# EAGLE design leadtech-arduino-CSPG_concept (EAGLE 9.1.3)
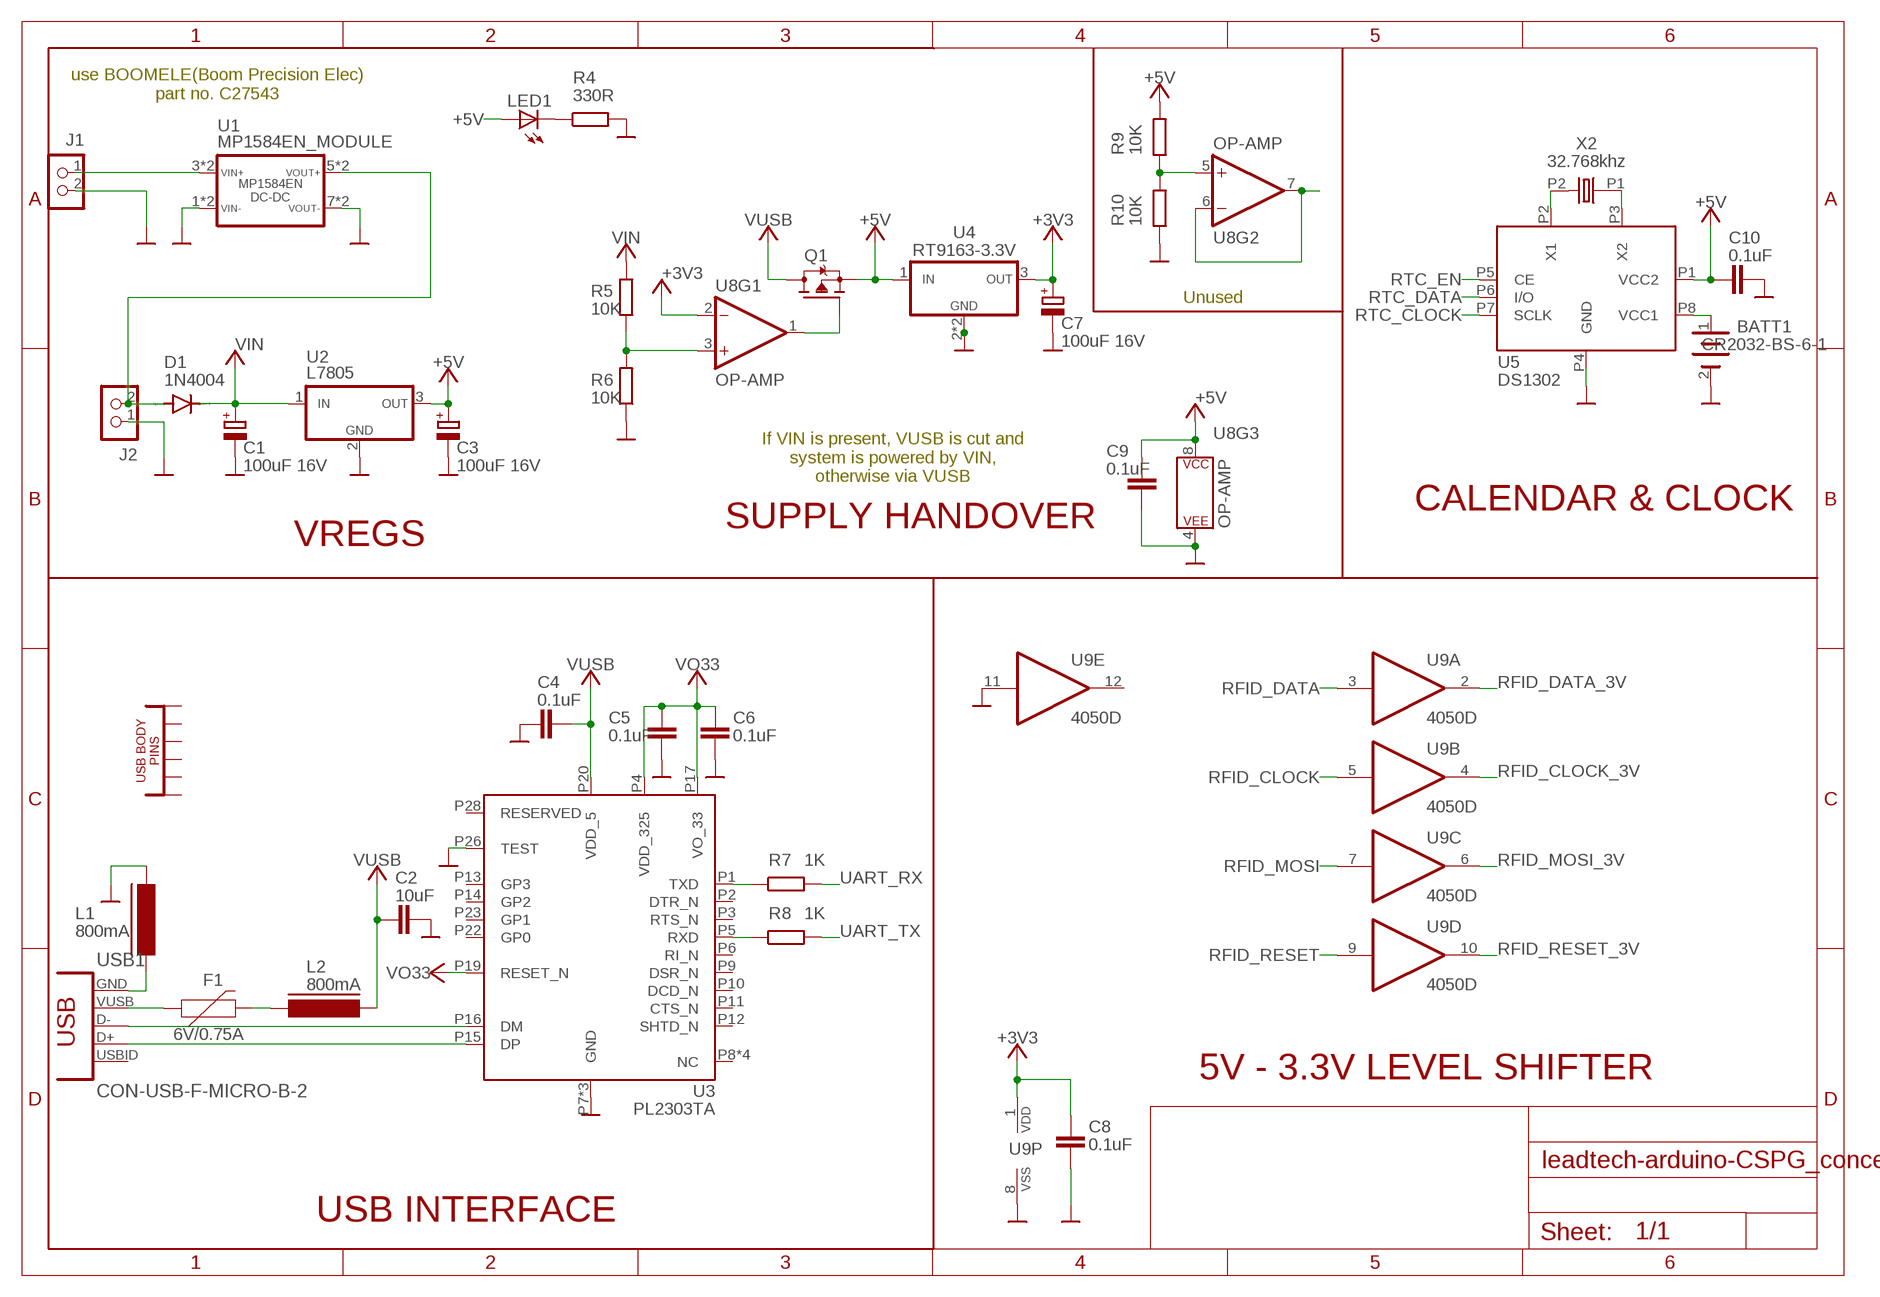
[diagram p0: schematic, sheet 1, part 1 of 2]
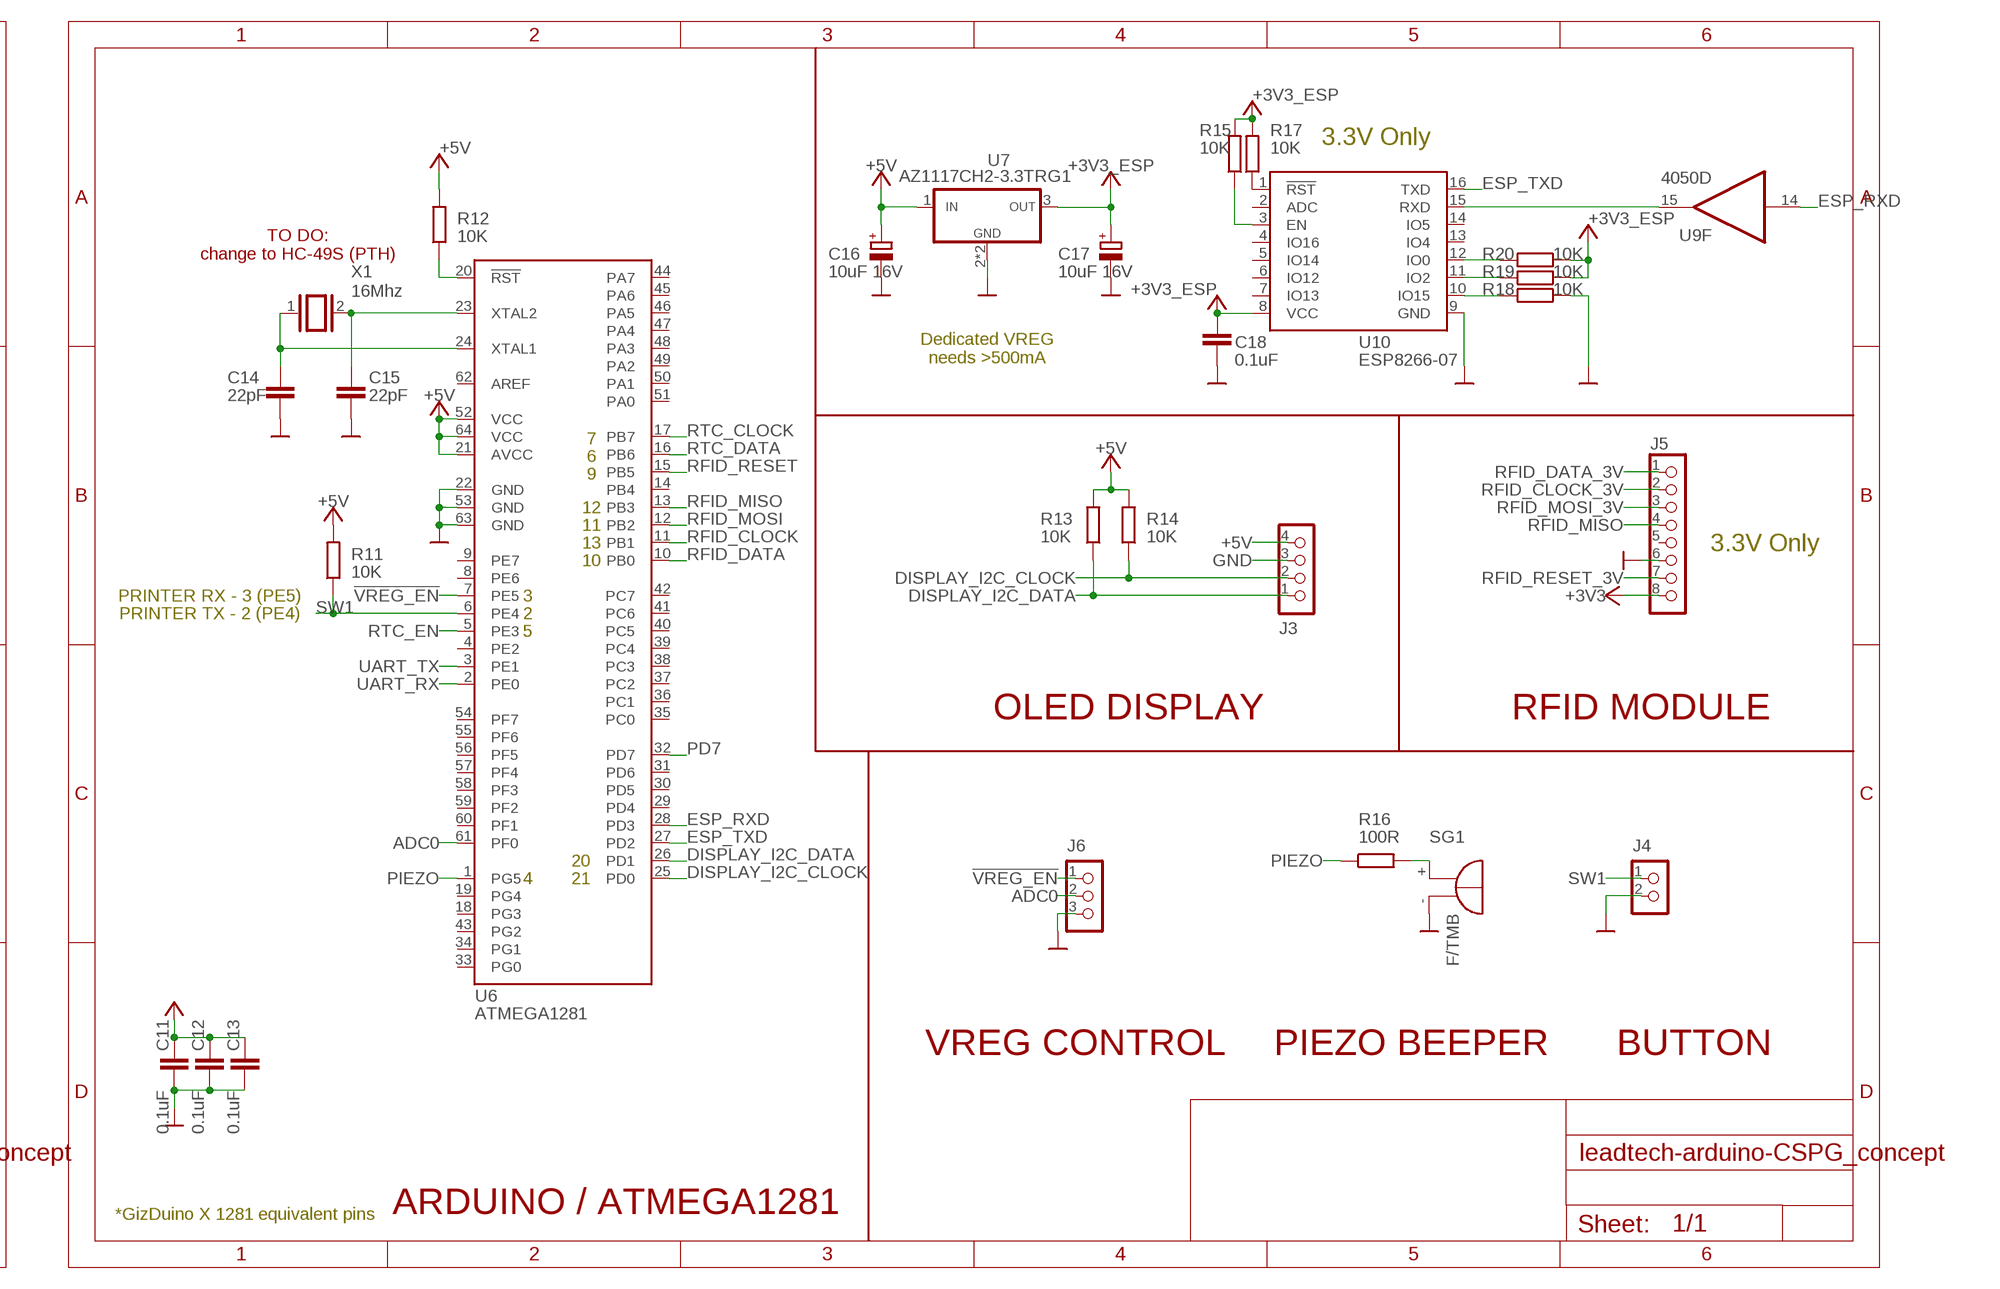
[diagram p1: schematic, sheet 1, part 2 of 2]

## Parts
BATT1  CR2032-BS-6-1  CR2032  [CR2032-BS-6]
C1  100uF 16V  CAPACITOR-POLCASE_C  [CASE_C]
C2  10uF  C-EUC0603  [C0603]
C3  100uF 16V  CAPACITOR-POLCASE_C  [CASE_C]
C4  0.1uF  C-EUC0603  [C0603]
C5  0.1uF  C-EUC0603  [C0603]
C6  0.1uF  C-EUC0603  [C0603]
C7  100uF 16V  CAPACITOR-POLCASE_C  [CASE_C]
C8  0.1uF  C-EUC0603  [C0603]
C9  0.1uF  C-EUC0603  [C0603]
C10  0.1uF  C-EUC0603  [C0603]
C11  0.1uF  C-EUC0603  [C0603]
C12  0.1uF  C-EUC0603  [C0603]
C13  0.1uF  C-EUC0603  [C0603]
C14  22pF  C-EUC0603  [C0603]
C15  22pF  C-EUC0603  [C0603]
C16  10uF 16V  CAPACITOR_POL-CASE_B  [CASE_B]
C17  10uF 16V  CAPACITOR_POL-CASE_B  [CASE_B]
C18  0.1uF  C-EUC0603  [C0603]
D1  1N4004  [DO41-10]
F1  6V/0.75A  PPTC_0.75A  [1206]
J1  CON_HX42003_2  [HX42003-2WAF]
J2  CON_HEADER_1X02-PTH  [M1X2]
J3  2510-4AGW  CON_KF2510-4AGW-2  [KF2510-4AGW-2]
J4  CON_KF2510-2AGW  [KF2510-2AGW]
J5  CON_HEADER_1X08-PTH  [M1X8]
J6  CON_KF2510-3A  [KF2510-3A]
L1  800mA  FERRITE-0805  [FB805]
L2  800mA  FERRITE-0805  [FB805]
LED1  LED-0805  [LED-805]
Q1  TRANSISTOR_FET_TSM2301CX  [SOT-23]
R4  330R  RESISTOR-0603  [R603]
R5  10K  RESISTOR-0603  [R603]
R6  10K  RESISTOR-0603  [R603]
R7  1K  RESISTOR-0603  [R603]
R8  1K  RESISTOR-0603  [R603]
R9  10K  RESISTOR-0603  [R603]
R10  10K  RESISTOR-0603  [R603]
R11  10K  R-EU_R0603  [R0603]
R12  10K  R-EU_R0603  [R0603]
R13  10K  R-EU_R0603  [R0603]
R14  10K  R-EU_R0603  [R0603]
R15  10K  RESISTOR-0603  [R603]
R16  100R  R-EU_R0603  [R0603]
R17  10K  RESISTOR-0603  [R603]
R18  10K  RESISTOR-0603  [R603]
R19  10K  RESISTOR-0603  [R603]
R20  10K  RESISTOR-0603  [R603]
SG1  F/TMB  [F/TMB]
U1  MP1584EN_MODULE  [MP1584EN_DCDC_MODULE]
U2  L7805  VREG-7805  [DPAK]
U3  PL2303TA  PL2303HX  [SSOP-28]
U4  RT9163-3.3V  VREG-RT9163  [SOT-223]
U5  DS1302  [SOIC-8]
U6  ATMEGA1281  [TQFP-64]
U7  AZ1117CH2-3.3TRG1  VREG-RT9163  [SOT-223]
U8  OP-AMP  OPAMP-DUALU  [SO08]
U9  4050D  [SO16]
U10  ESP8266-07  [ESP8266-07]
USB1  CON-USB-F-MICRO-B-2  [CON_USB_MICRO-B-2-SD-47589-001]
X1  16Mhz  XTAL/S  [QS]
X2  32.768khz  OSC-XTALTC-26  [TC-26]

## Nets
!VREG_EN: J6.1 U6.7(PE5)
+3V3: C7.+ C8.2 J5.8 U4.3(VOUT) U8.2(-IN) U9.1(P:VDD) ; supply symbol labelled SUPPLY_+5V
+3V3_ESP: C17.+ C18.2 R15.2 R17.2 R18.1 R19.1 U7.3(VOUT) U10.8(VCC) ; supply symbol labelled SUPPLY_+5V
+5V: C3.+ C9.2 C10.1 C11.1 C12.1 C13.1 C16.+ J3.4 LED1.A Q1.2(S) R9.2 R11.2 R12.2 R13.2 R14.2 U2.3(VOUT) U4.1(VIN) U5.P1(VCC2) U6.21(AVCC) U6.52(VCC) U6.64(VCC) U7.1(VIN) U8.8(P$V+) ; supply symbol labelled SUPPLY_+5V
ADC0: J6.2 U6.61(PF0)
DISPLAY_I2C_CLOCK: J3.2 R14.1 U6.25(PD0)
DISPLAY_I2C_DATA: J3.1 R13.1 U6.26(PD1)
ESP_RXD: U6.28(PD3) U9.14(F:I)
ESP_TXD: U6.27(PD2) U10.16(TXD)
GND: BATT1.2(B-) C1.- C2.1 C3.- C4.1 C5.2 C6.2 C7.- C8.1 C9.1 C10.2 C11.2 C12.2 C13.2 C14.1 C15.1 C16.- C17.- C18.1 J1.2 J2.1 J3.3 J4.2 J5.6 J6.3 L1.1 R4.2 R6.1 R10.1 R20.1 SG1.- U1.1(VIN-) U1.2(VIN-) U1.7(VOUT-) U1.8(VOUT-) U2.2(GND) U3.P7(GND) U3.P18(GND) U3.P25(GND) U3.P26(TEST) U4.2(GND) U4.4(GND) U5.P4(GND) U6.22(GND) U6.53(GND) U6.63(GND) U7.2(GND) U7.4(GND) U8.4(P$V-) U9.8(P:VSS) U9.11(E:I) U10.9(GND) ; supply symbol labelled SUPPLY_GND
N$1: R17.1 U10.1(!RST)
N$2: R15.1 U10.3(EN)
N$3: R12.1 U6.20(!RST)
N$4: Q1.1(G) U8.1(OUT)
N$5: R5.1 R6.2 U8.3(+IN)
N$6: U8.6(-IN) U8.7(OUT)
N$7: J1.1 U1.3(VIN+) U1.4(VIN+)
N$8: C15.2 U6.23(XTAL2) X1.2
N$9: R9.1 R10.2 U8.5(+IN)
N$10: C14.2 U6.24(XTAL1) X1.1
N$11: U3.P16(DM) USB1.P2(D-)
N$12: U3.P15(DP) USB1.P3(D+)
N$13: F1.1 USB1.P1(VUSB)
N$14: F1.2 L2.2
N$16: L1.2 USB1.P5(GND)
N$17: R7.1 U3.P1(TXD)
N$18: R8.1 U3.P5(RXD)
N$19: D1.A J2.2 U1.5(VOUT+) U1.6(VOUT+)
N$20: R16.2 SG1.+
N$21: LED1.C R4.1
N$22: U5.P3(X2) X2.P1
N$23: U5.P2(X1) X2.P2
N$24: BATT1.1(B+) U5.P8(VCC1)
N$25: R20.2 U10.10(IO15)
N$26: R19.2 U10.11(IO2)
N$27: R18.2 U10.12(IO0)
N$28: U9.15(F:O) U10.15(RXD)
PD7: U6.32(PD7)
PIEZO: R16.1 U6.1(PG5)
RFID_CLOCK: U6.11(PB1) U9.5(B:I)
RFID_CLOCK_3V: J5.2 U9.4(B:O)
RFID_DATA: U6.10(PB0) U9.3(A:I)
RFID_DATA_3V: J5.1 U9.2(A:O)
RFID_MISO: J5.4 U6.13(PB3)
RFID_MOSI: U6.12(PB2) U9.7(C:I)
RFID_MOSI_3V: J5.3 U9.6(C:O)
RFID_RESET: U6.15(PB5) U9.9(D:I)
RFID_RESET_3V: J5.7 U9.10(D:O)
RTC_CLOCK: U5.P7(SCLK) U6.17(PB7)
RTC_DATA: U5.P6(I/O) U6.16(PB6)
RTC_EN: U5.P5(CE) U6.5(PE3)
SW1: J4.1 R11.1 U6.6(PE4)
UART_RX: R7.2 U6.2(PE0)
UART_TX: R8.2 U6.3(PE1)
VIN: C1.+ D1.C R5.2 U2.1(VIN) ; supply symbol labelled SUPPLY_+5V
VO33: C5.1 C6.1 U3.P4(VDD_325) U3.P17(VO_33) U3.P19(RESET_N) ; supply symbol labelled SUPPLY_+5V
VUSB: C2.2 C4.2 L2.1 Q1.3(D) U3.P20(VDD_5) ; supply symbol labelled SUPPLY_+5V
Unconnected: J5.5 U3.P2(DTR_N) U3.P3(RTS_N) U3.P6(RI_N) U3.P8(NC) U3.P9(DSR_N) U3.P10(DCD_N) U3.P11(CTS_N) U3.P12(SHTD_N) U3.P13(GP3) U3.P14(GP2) U3.P21(NC) U3.P22(GP0) U3.P23(GP1) U3.P24(NC) U3.P27(NC) U3.P28(RESERVED) U6.4(PE2) U6.8(PE6) U6.9(PE7) U6.14(PB4) U6.18(PG3) U6.19(PG4) U6.29(PD4) U6.30(PD5) U6.31(PD6) U6.33(PG0) U6.34(PG1) U6.35(PC0) U6.36(PC1) U6.37(PC2) U6.38(PC3) U6.39(PC4) U6.40(PC5) U6.41(PC6) U6.42(PC7) U6.43(PG2) U6.44(PA7) U6.45(PA6) U6.46(PA5) U6.47(PA4) U6.48(PA3) U6.49(PA2) U6.50(PA1) U6.51(PA0) U6.54(PF7) U6.55(PF6) U6.56(PF5) U6.57(PF4) U6.58(PF3) U6.59(PF2) U6.60(PF1) U6.62(AREF) U9.12(E:O) U10.2(ADC) U10.4(IO16) U10.5(IO14) U10.6(IO12) U10.7(IO13) U10.13(IO4) U10.14(IO5) USB1.BODY@1 USB1.BODY@2 USB1.BODY@3 USB1.BODY@4 USB1.BODY@5 USB1.BODY@6 USB1.BODY@7 USB1.BODY@8 USB1.BODY@9 USB1.BODY@10 USB1.P4(USBID)

## Notes on the sheet
- use BOOMELE(Boom Precision Elec)
  part no. C27543
- 3.3V Only
- TO DO:
  change to HC-49S (PTH)
- Unused
- Dedicated VREG
  needs >500mA
- 7
- If VIN is present, VUSB is cut and
  system is powered by VIN,
  otherwise via VUSB
- 6
- 9
- CALENDAR & CLOCK | 12
- SUPPLY HANDOVER | 11
- VREGS | 13 | 3.3V Only
- 10
- PRINTER RX - 3 (PE5) | 3
- PRINTER TX - 2 (PE4) | 2
- 5
- OLED DISPLAY | RFID MODULE
- 20
- 4 | 21
- VREG CONTROL | PIEZO BEEPER | BUTTON
- 5V - 3.3V LEVEL SHIFTER
- USB INTERFACE | *GizDuino X 1281 equivalent pins | ARDUINO / ATMEGA1281

## Library data of the parts
BATT1 = trosh_devices.eagle.v9:CR2032
C1 C3 C7 = trosh_devices.eagle.v9:CAPACITOR-POL
C2 C4-C6 C8-C15 C18 = rcl:C-EU: CAPACITOR, European symbol; SPICEPREFIX: C
C16 C17 = dp_devices.v6:CAPACITOR_POL: Polarized capacitor in various packages
D1 = diode:1N4004: DIODE general purpose rectifier, 1 A
F1 = SparkFun-Fuses:PPTC: Resettable Fuse PPTC Resettable Fuse. Really a sort of resistor with a polymeric positive temperature coefficient whose resistance increases dramatically with an increase in temperature. When heated by the power passing through the resistance rises causing the current to be limited, protecting the circuit. This is achieved by the transition of the polymer from a crystalline to an amorphous state where the conductive carbon separates breaking the conductive pathways found in the cool crystalline structure. When a PPTC cools back down it resumes conducting letting the circuit turn back on. SparkFun Products: SparkFun RedBoard - Programmed with Arduino <https://www.sparkfun.com/products/12757> Pro Micro - 5V/16MHz <https://www.sparkfun.com/products/12640> Arduino Pro 328 - 5V/16MHz <https://www.sparkfun.com/products/10915> MP3 Trigger <https://www.sparkfun.com/products/13720>; PROD_ID: RES-11150
J1 = trosh_devices.eagle.v9:CON_HX42003_2: Similar 5569 series
J2 = dp_devices.v6:CON_HEADER_1X02
J3 = trosh_devices.eagle.v9:CON_KF2510-4AGW-2
J4 = trosh_devices.eagle.v9:CON_KF2510-2AGW: KF2510 alike part no: C30436
J5 = dp_devices.v6:CON_HEADER_1X08
J6 = trosh_devices.eagle.v9:CON_KF2510-3A
L1 L2 = dp_devices.v6:FERRITE: Ferrite bead in various packages
LED1 = dp_devices.v6:LED: Light Emitting Diode
Q1 = dp_devices.v6:TRANSISTOR_FET_TSM2301CX: 20V P-Channel Enhancement Mode MOSFET
R4-R10 R15 R17-R20 = dp_devices.v6:RESISTOR
R11-R14 R16 = rcl:R-EU_: RESISTOR, European symbol; SPICEPREFIX: R
SG1 = buzzer:F/TMB: BUZZER Source: Buerklin; OC_FARNELL: unknown; OC_NEWARK: unknown
U1 = trosh_devices.eagle.v9:MP1584EN_MODULE
U2 = trosh_devices.eagle.v9:VREG-7805: 1.5A Positive voltage regulator
U3 = trosh_devices.eagle.v9:PL2303HX: USB to serial bridge controller
U4 U7 = trosh_devices.eagle.v9:VREG-RT9163: 500mA Low Dropout Positive Voltage Regulator
U5 = trosh_devices.eagle.v9:DS1302: Trickle-charge timekeeping chip
U6 = trosh_devices.eagle.v9:ATMEGA1281
U8 = SparkFun-IC-Amplifiers:OPAMP-DUAL: Generic op-amp footprint This component is for the standard 358 pinning of a dual op-amp From the LM358 datasheet: Pin 1: Output A Pin 2: Inverting Input A Pin 3: Non-Inverting Input A Pin 4: Gnd Pin 5: Non-Inverting Input B Pin 6: Inverting Input B Pin 7: Output B Pin 8: V+; PROD_ID: NA-XXXXX
U9 = 40xx:4050: Hex non-inverting BUFFER
U10 = trosh_devices.eagle.v9:ESP8266-07: ESP-07 802.11 b/g/n Wi-Fi Module
USB1 = dp_devices.v6:CON-USB-F-MICRO-B-2: Micro USB based on molex SD-47589-001
X1 = special:XTAL/S: CRYSTAL
X2 = dp_devices.v6:OSC-XTAL

## Board
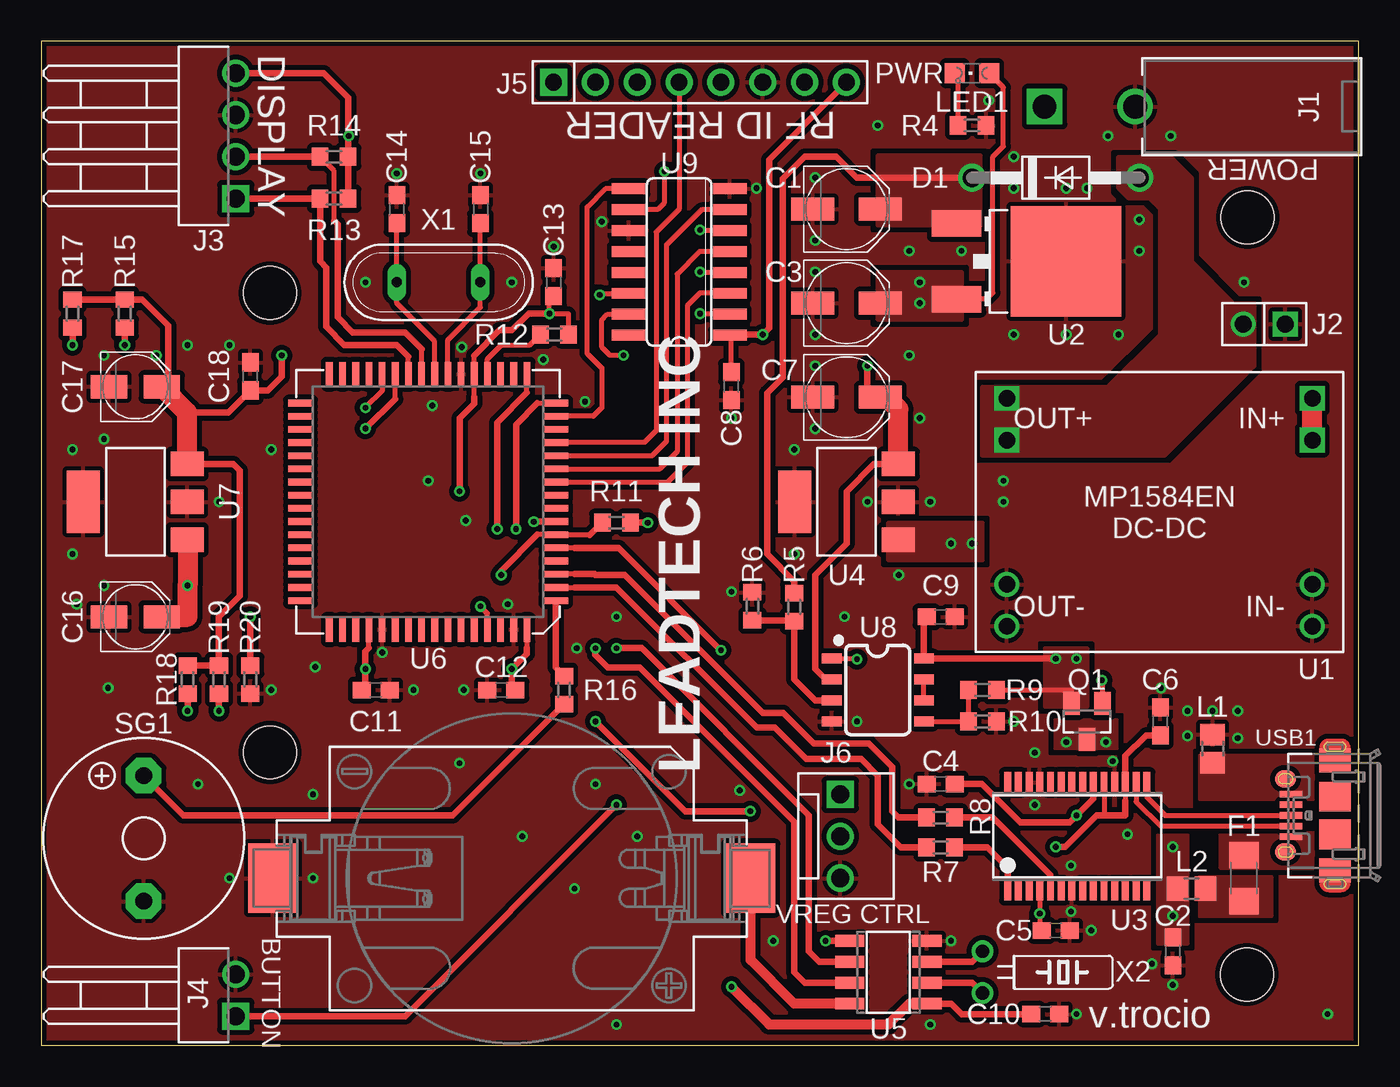
[diagram p2: board, top side]
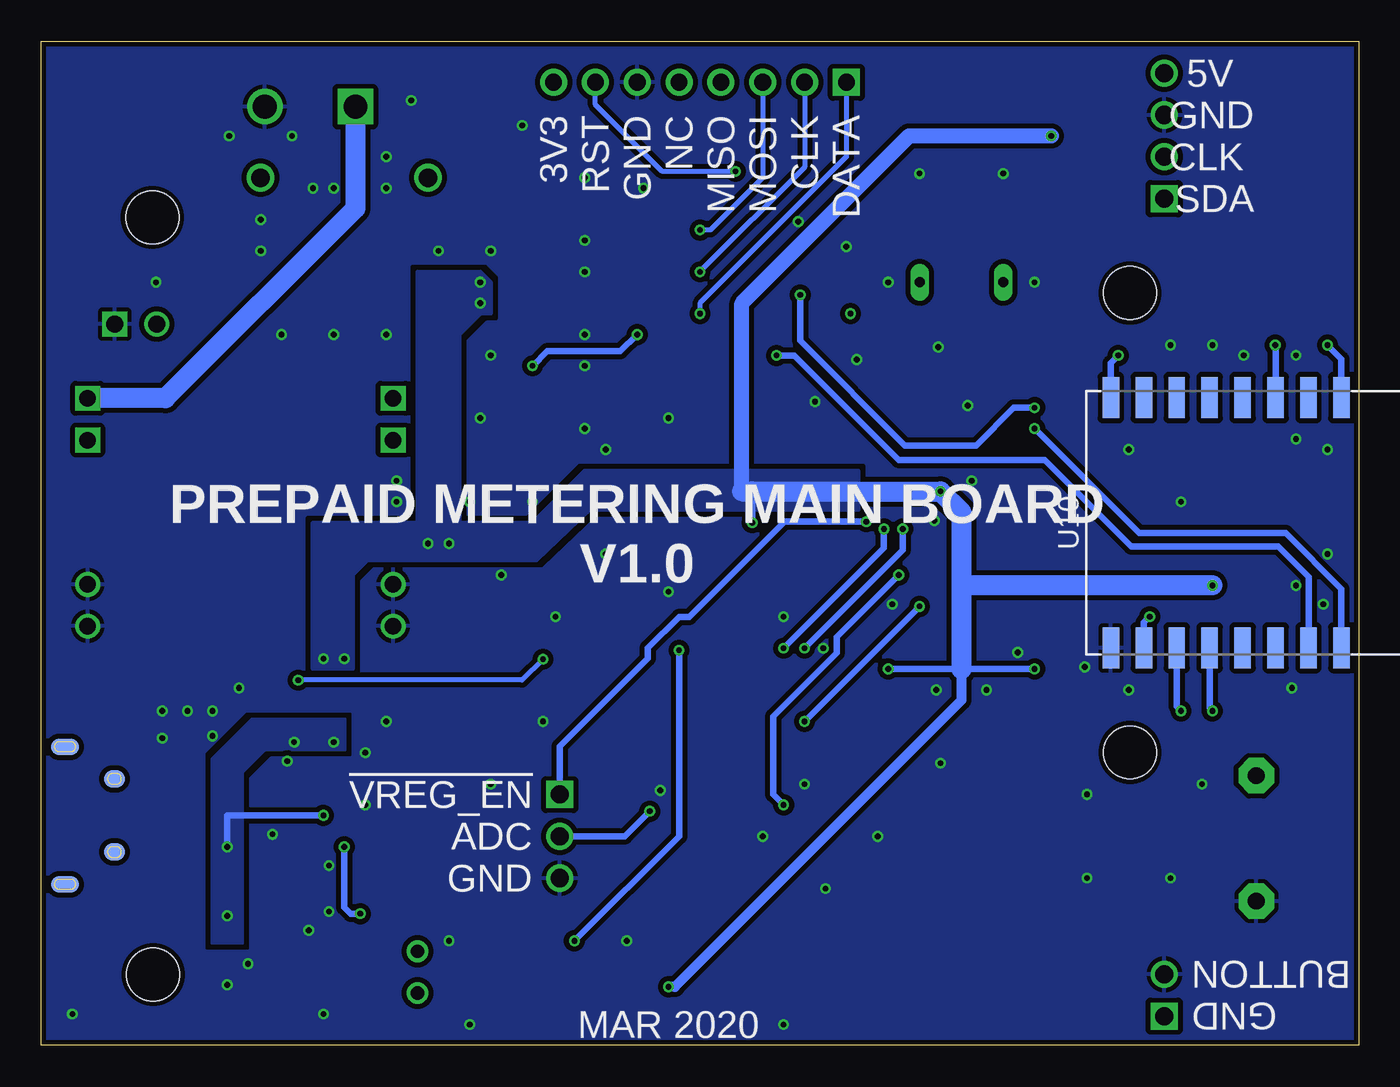
[diagram p3: board, bottom side, seen from below]

Size 80 x 61 mm. Coordinates in mm from the lower left corner, seen from the top.
Outline: 0,61 0,0 80,0 80,61 0,61
Copper layers (1*16): Top 0.035mm / dielectric 1.5mm / Bottom 0.035mm
Design rules "dirt_cheap_dirty_boards.v1.1": minimum track width 6mil, minimum drill 12mil, track to track 6mil, track to pad 6mil, pad to pad 6mil, via to via 6mil, smd to smd 0mil, copper to edge 10mil, drill to drill 10mil, minimum pad ring 10mil, minimum via ring 6mil, stop-mask expansion 2mil, vias tented up to drill 25mil, thermal gap 10mil
Holes 3.2 mm at 13.9,45.7 73.25,50.3 73.2,4.3 13.9,17.8
tKeepout: area 70.2,1.3 to 76.2,7.3; area 70.2,47.3 to 76.2,53.3; area 10.9,42.7 to 16.9,48.7; area 10.9,14.8 to 16.9,20.8

### Footprints (pad centres in the part's own frame; a part is rotated, then mirrored left to right if it is on the bottom)
CR2032-BS-6 = smd 3 x 4.2: 1 14.5,0; 2 -14.5,0
CASE_C = smd 2.6 x 1.4: + 2.05,0; - -2.05,0
C0603 = smd 1.1 x 1: 1 -0.85,0; 2 0.85,0
CASE_B = smd 2.2 x 1.4: + 1.6,0; - -1.6,0
DO41-10 = drill 1.118: A 5.08,0; C -5.08,0
1206 = smd 1.6 x 1.8: 1 -1.4,0; 2 1.4,0
HX42003-2WAF = drill 1.44 square: 1 0,5.5 | drill 1.44: 2 0,0
M1X2 = drill 1.02 square: 1 -1.27,0 | drill 1.02: 2 1.27,0
KF2510-4AGW-2 = drill 1.1 square: 1 0,0 | drill 1.1: 2 2.54,0; 3 5.08,0; 4 7.62,0
KF2510-2AGW = drill 1.1 square: 1 0,0 | drill 1.1: 2 2.54,0
M1X8 = drill 1.02 pad 1.632 square: 1 -8.89,0 | drill 1.02 pad 1.632: 2 -6.35,0; 3 -3.81,0; 4 -1.27,0; 5 1.27,0; 6 3.81,0; 7 6.35,0; 8 8.89,0
KF2510-3A = drill 1.1 square: 1 0,0 | drill 1.1: 2 -2.54,0; 3 -5.08,0
FB805 = smd 1.3 x 1.5: 1 -0.85,0; 2 0.85,0
LED-805 = smd 1.2 x 1.2: A 0,-1.05; C 0,1.05
SOT-23 = smd 1 x 1.4: 1 -0.95,-1.1; 2 0.95,-1.1; 3 0,1.1
R603 = smd 1 x 1.1: 1 -0.85,0; 2 0.85,0
R0603 = smd 1 x 1.1: 1 -0.85,0; 2 0.85,0
F/TMB = drill 1.016 pad 2.159 octagon: + 3.81,0; - -3.81,0
MP1584EN_DCDC_MODULE = drill 1: 1 -9.271,6.922; 2 -9.271,4.382; 7 9.271,4.382; 8 9.271,6.922 | drill 1 square: 3 -9.271,-4.382; 4 -9.271,-6.922; 5 9.271,-6.922; 6 9.271,-4.382
DPAK = smd 1.6 x 3: 1 -2.3,-6.65; 3 2.3,-6.65 | smd 6.7 x 6.7: 2 0,0
SSOP-28 = smd 0.42 x 1.25: P1 -4.225,-3.275; P2 -3.575,-3.275; P3 -2.925,-3.275; P4 -2.275,-3.275; P5 -1.625,-3.275; P6 -0.975,-3.275; P7 -0.325,-3.275; P8 0.325,-3.275; P9 0.975,-3.275; P10 1.625,-3.275; P11 2.275,-3.275; P12 2.925,-3.275; P13 3.575,-3.275; P14 4.225,-3.275; P15 4.225,3.275; P16 3.575,3.275; P17 2.925,3.275; P18 2.275,3.275; P19 1.625,3.275; P20 0.975,3.275; P21 0.325,3.275; P22 -0.325,3.275; P23 -0.975,3.275; P24 -1.625,3.275; P25 -2.275,3.275; P26 -2.925,3.275; P27 -3.575,3.275; P28 -4.225,3.275
SOT-223 = smd 1.5 x 2: 1 -2.3,-3.15; 2 0,-3.15; 3 2.3,-3.15 | smd 3.8 x 2: 4 0,3.15
SOIC-8 = smd 0.72 x 1.78: P1 -1.905,-2.34; P2 -0.635,-2.34; P3 0.635,-2.34; P4 1.905,-2.34; P5 1.905,2.34; P6 0.635,2.34; P7 -0.635,2.34; P8 -1.905,2.34
TQFP-64 = smd 1.5 x 0.406: 1 -7.75,6; 2 -7.75,5.2; 3 -7.75,4.4; 4 -7.75,3.6; 5 -7.75,2.8; 6 -7.75,2; 7 -7.75,1.2; 8 -7.75,0.4; 9 -7.75,-0.4; 10 -7.75,-1.2; 11 -7.75,-2; 12 -7.75,-2.8; 13 -7.75,-3.6; 14 -7.75,-4.4; 15 -7.75,-5.2; 16 -7.75,-6; 33 7.75,-6; 34 7.75,-5.2; 35 7.75,-4.4; 36 7.75,-3.6; 37 7.75,-2.8; 38 7.75,-2; 39 7.75,-1.2; 40 7.75,-0.4; 41 7.75,0.4; 42 7.75,1.2; 43 7.75,2; 44 7.75,2.8; 45 7.75,3.6; 46 7.75,4.4; 47 7.75,5.2; 48 7.75,6 | smd 0.406 x 1.5: 17 -6,-7.75; 18 -5.2,-7.75; 19 -4.4,-7.75; 20 -3.6,-7.75; 21 -2.8,-7.75; 22 -2,-7.75; 23 -1.2,-7.75; 24 -0.4,-7.75; 25 0.4,-7.75; 26 1.2,-7.75; 27 2,-7.75; 28 2.8,-7.75; 29 3.6,-7.75; 30 4.4,-7.75; 31 5.2,-7.75; 32 6,-7.75; 49 6,7.75; 50 5.2,7.75; 51 4.4,7.75; 52 3.6,7.75; 53 2.8,7.75; 54 2,7.75; 55 1.2,7.75; 56 0.4,7.75; 57 -0.4,7.75; 58 -1.2,7.75; 59 -2,7.75; 60 -2.8,7.75; 61 -3.6,7.75; 62 -4.4,7.75; 63 -5.2,7.75; 64 -6,7.75
SO08 = smd 0.6 x 1.2: 1 -1.905,-2.8; 2 -0.635,-2.8; 3 0.635,-2.8; 4 1.905,-2.8; 5 1.905,2.8; 6 0.635,2.8; 7 -0.635,2.8; 8 -1.905,2.8
SO16 = smd 0.66 x 2.032: 1 -4.445,-3.073; 2 -3.175,-3.073; 3 -1.905,-3.073; 4 -0.635,-3.073; 5 0.635,-3.073; 6 1.905,-3.073; 7 3.175,-3.073; 8 4.445,-3.073; 9 4.445,3.073; 10 3.175,3.073; 11 1.905,3.073; 12 0.635,3.073; 13 -0.635,3.073; 14 -1.905,3.073; 15 -3.175,3.073; 16 -4.445,3.073
ESP8266-07 = smd 2.5 x 1: 1 -7.6,7.2; 2 -7.6,5.2; 3 -7.6,3.2; 4 -7.6,1.2; 5 -7.6,-0.8; 6 -7.6,-2.8; 7 -7.6,-4.8; 8 -7.6,-6.8; 9 7.6,-6.8; 10 7.6,-4.8; 11 7.6,-2.8; 12 7.6,-0.8; 13 7.6,1.2; 14 7.6,3.2; 15 7.6,5.2; 16 7.6,7.2
CON_USB_MICRO-B-2-SD-47589-001 = smd 1.05 x 1.25: BODY@1 -2.225,3.35; BODY@3 2.225,3.35 | smd 1.05 x 1.25 bottom: BODY@2 -2.225,3.35; BODY@4 2.225,3.35 | smd 1.48 x 1.9: BODY@5 -3.338,0.35; BODY@9 3.338,0.35 | smd 1 x 1.7 bottom: BODY@6 -4.175,0.35; BODY@10 4.175,0.35 | smd 1.8 x 1.9: BODY@7 -1.15,0.35; BODY@8 1.15,0.35 | smd 0.4 x 1.35: P1 -1.3,3.025; P2 -0.65,3.025; P3 0,3.025; P4 0.65,3.025; P5 1.3,3.025
QS = drill 0.61 long: 1 -2.54,0; 2 2.54,0
TC-26 = drill 0.8: P1 -1.27,-2.54; P2 1.27,-2.54

### Placement (x,y rotation side)
BATT1  28.57,10.16 0 top
C1  48.9,50.8 0 top
C2  68.71,5.71 90 top
C3  48.9,45.09 0 top
C4  54.61,15.88 0 top
C5  61.59,6.99 0 top
C6  67.94,19.68 90 top
C7  48.9,39.37 0 top
C8  41.91,40.05 90 top
C9  54.61,26.04 180 top
C10  60.96,1.91 0 top
C11  20.32,21.59 0 top
C12  27.94,21.59 180 top
C13  31.11,46.35 90 top
C14  21.59,50.8 270 top
C15  26.67,50.8 270 top
C16  5.71,26.04 0 top
C17  5.71,40.01 0 top
C18  12.7,40.64 270 top
D1  61.59,52.7 0 top
F1  73.03,10.16 270 top
J1  66.42,57.02 90 top
J2  74.25,43.81 180 top
J3  11.81,51.44 90 top
J4  11.81,1.78 90 top
J5  40,58.5 0 top
J6  48.51,15.24 90 top
L1  71.12,18.03 270 top
L2  69.85,9.53 0 top
LED1  56.52,59.05 90 top
Q1  63.5,19.68 180 top
R4  56.52,55.88 0 top
R5  45.72,26.63 90 top
R6  43.18,26.67 270 top
R7  54.61,12.03 180 top
R8  54.61,13.84 180 top
R9  57.15,21.59 0 top
R10  57.15,19.68 180 top
R11  34.92,31.75 0 top
R12  31.16,43.18 0 top
R13  17.78,51.44 0 top
R14  17.78,53.98 0 top
R15  5.08,44.45 90 top
R16  31.75,21.59 270 top
R17  1.91,44.45 90 top
R18  8.89,22.23 270 top
R19  10.79,22.23 270 top
R20  12.7,22.23 90 top
SG1  6.22,12.57 90 top
U1  67.91,32.38 180 top
U2  62.23,47.62 270 top
U3  62.91,12.7 0 top
U4  48.9,33.02 90 top
U5  51.44,4.45 90 top
U6  23.5,33.02 180 top
U7  5.71,33.02 90 top
U8  50.8,21.59 270 top
U9  38.73,47.59 90 top
U10  8.26,31.75 270 bottom
USB1  78.9,13.97 90 top
X1  24.13,46.35 0 top
X2  59.69,4.45 270 top

### Tracks (layer width: path | path; a pad name or v marks a point on that pad's centre or on a via)
!VREG_EN  (via drill 0.35)
  Top 0.406: U6.7 v29.91,31.82 v29.91,31.81
  Bottom 0.406: v29.91,31.81 34.86,31.81 40.64,26.04 41.27,26.04 43.18,24.13 43.18,23.5 48.51,18.16 J6.1
+3V3  (via drill 0.35)
  Top 0.305: C8.2 41.91,43.04 U9.1
  Top 0.406: J5.8 44.2,53.8 44.2,43.56 v43.81,43.18 41.85,43.18 U9.1 | U4.3 50.56,35.32 48.9,33.66 48.9,30.48 46.99,28.57 46.99,22.86 47.62,22.23 U8.2 | v50.16,41.27 50.16,39.7 50.49,39.37 C7.+
  Top 1.219: U4.3 52.05,38.65 51.33,39.37 C7.+
  Bottom 0.406: v50.16,41.27 49.28,42.16 44.83,42.16 v43.81,43.18
+3V3_ESP  (via drill 0.35)
  Top 0.406: v14.61,41.91 14.61,40.64 13.76,39.79 C18.2 11.37,38.45 8.87,38.45 | R17.2 R15.2 6.13,45.3 7.72,43.72 7.72,40.41 C17.+ | R18.1 R19.1 10.79,26.04 12.06,27.3 12.06,34.92 11.67,35.32 U7.3
  Top 1.219: U7.3 8.87,38.45 C17.+
  Bottom 0.406: U10.8 15.05,41.46 v14.61,41.91
+5V  (via drill 0.35)
  Top 0.305: C13.1 30.86,45.68 v30.86,44.45 32.01,44.45 R12.2 | 19.89,24.13 U6.52 | U6.64 29.5,24.13 | R9.2 62.55,21.59 | 26.3,41.91 U6.21 26.29,39.37 | U2.3 57.39,45.33 57.78,45.72 57.78,53.98 58.42,54.61 58.42,58.2 LED1.A
  Top 0.406: v61.6,23.5 U8.8 53.6,25.88 C9.2 | v36.83,31.75 R11.2 | 19.89,24.13 19.68,23.92 v19.68,22.86 19.68,21.59 C11.1 | J3.4 17.14,59.05 18.63,57.57 18.63,55.24 | 18.63,55.24 R14.2 R13.2 | v30.86,44.45 29.59,44.45 28.57,43.43 27.82,43.43 26.3,41.91 | v18.67,55.24 18.63,55.24 | 29.5,24.13 29.5,23.78 v28.57,22.86 28.57,21.59 C12.1 | v25.4,33.66 25.4,38.1 26.29,38.99 26.29,39.37 | C10.1 55.88,1.91 55.24,2.54 U5.P1
  Top 0.61: U5.P1 52.7,2.54 51.44,1.27 44.2,1.27 v41.91,3.56
  Top 1.219: U7.1 8.89,30.72 v8.89,27.94 8.89,26.04 C16.+
  Bottom 0.406: v19.68,22.86 24.13,22.86 v28.57,22.86 | 36.83,33.66 v36.83,31.75
  Bottom 0.61: 24.13,22.86 24.13,20.95 41.53,3.56 v41.91,3.56
  Bottom 0.914: 37.47,33.66 37.47,45.09 27.3,55.24 v18.67,55.24
  Bottom 1.219: 37.47,33.66 36.83,33.66 v25.4,33.66 24.13,32.38 24.13,27.94 | 24.13,27.94 24.13,22.86 | v8.89,27.94 24.13,27.94
  other vias: 62.87,23.5 56.52,30.48 53.34,45.09 55.24,30.48 53.34,46.35
  pour Top (isolate 0.305, no thermals): 50.8,46.99 55.88,46.99 55.88,44.07 50.8,44.07
  pour Bottom (isolate 0.305, no thermals): 57.15,46.99 53.34,46.99 52.7,46.35 52.7,44.45 53.34,44.45 54.61,43.18 54.61,29.46 57.15,29.46
  pour Top (isolate 0.305, no thermals): 51.44,31.75 57.15,31.75 57.15,29.46 51.44,29.46
  pour Bottom (isolate 0.305, no thermals): 30.39,34.92 30.39,32.51 46.74,32.51 49.93,29.46 57.15,29.46 57.15,31.75 50.16,31.75 46.99,34.92
  pour Bottom (isolate 0.305, no thermals): 63.5,31.75 54.61,31.75 54.61,29.46 60.2,29.46 61.09,28.57 61.09,22.86 63.5,22.86
  pour Top (isolate 0.305, no thermals): 60.96,24.13 63.5,24.13 63.5,20.57 60.96,20.57
ADC0  (via drill 0.35)
  Top 0.305: U6.61 27.09,26.25 v26.67,26.67
  Top 0.406: v33.66,19.68 39.12,14.22 v43.05,14.22
  Bottom 0.406: v26.67,26.67 v33.66,19.68 | J6.2 44.58,12.7 v43.05,14.22
DISPLAY_I2C_CLOCK
  Top 0.305: R14.1 17.78,53.12 17.78,50.1 | U6.25 23.09,42.31
  Top 0.406: J3.2 R14.1 | 23.09,42.31 22.1,43.31 18.92,43.31 18,44.23 18,49.88 17.78,50.1
DISPLAY_I2C_DATA
  Top 0.305: U6.26 22.3,41.84
  Top 0.406: J3.1 R13.1 16.93,47.62 17.31,47.24 17.31,43.65 18.41,42.55 21.59,42.55 22.3,41.84
ESP_RXD  (via drill 0.35)
  Top 0.305: U6.28 20.7,39.74 v19.68,38.73 | v33.91,45.59 34,45.68 U9.14
  Bottom 0.406: v19.68,38.73 20.95,38.73 23.24,36.45 27.56,36.45 33.91,42.8 v33.91,45.59
ESP_TXD  (via drill 0.35)
  Top 0.305: 21.5,39.27 U6.27
  Top 0.406: v19.68,37.47 21.5,39.27
  Bottom 0.406: U10.16 1.05,27.73 4.45,31.11 13.34,31.11 v19.68,37.47
GND  (via drill 0.35)
  other vias: 65.95,12.83 65.06,17.27 60.33,14.61 60.33,17.78 62.52,10.92 62.52,8.13 55.24,6.35 52.7,15.88 48.77,26.04 53.98,33.02 49.53,19.68 43.43,52.07 41.91,38.1 46.99,41.27 46.99,52.7 46.99,48.9 53.34,38.1 46.99,37.47 62.87,1.91 59.05,19.68 67.98,21.72 16.51,10.16 11.43,10.16 46.99,46.99 46.99,43.18 63.75,6.99 50.8,55.88 63.5,52.07 57.53,57.4 21.59,52.96 26.67,52.96 19.68,46.35 28.57,46.35 3.81,27.94 2.16,26.8 4.06,21.72 6.99,41.91 3.81,41.91 3.81,36.83 1.91,36.2 1.91,29.84 10.79,33.02 11.43,42.55 8.89,42.55 13.97,21.59 41.91,27.56 28.32,26.8 20.7,23.88 31.11,48.51 33.02,39.12 25.53,42.42 23.75,38.86 23.5,34.29 16.64,22.99 22.61,21.59 25.65,21.59 45.72,36.2 45.72,29.84 71.12,20.32 72.64,20.32 69.6,20.32 72.64,18.67 67.44,4.95 68.71,3.68 16.51,15.24 9.53,15.88 29.21,12.7 25.4,17.14 33.66,15.88 32.38,9.53 36.2,12.7 30.48,41.66 34.04,50.04 69.6,18.8 68.58,55.24 62.23,43.18 62.23,52.07 59.05,43.18 64.77,55.24 73.03,46.35 52.7,41.91 65.41,43.18 50.16,33.02 58.42,33.02 58.42,34.29 52.07,28.57 66.67,48.26 66.67,50.16 55.88,48.26 52.7,48.26 59.05,53.98 59.05,52.07 34.92,26.04 32.51,24.13 44.45,6.35 53.98,1.27 34.92,1.27 78.11,1.91 25.78,31.88 13.97,36.2 42.42,15.49
  pour Top (isolate 0.305, rank 6): 0,61 80,61 80,0 0,0
  pour Bottom (isolate 0.305, rank 6): 0,61 80,61 80,0 0,0
N$1  (via drill 0.35)
  Top 0.406: v1.91,42.55 R17.1
  Bottom 0.406: U10.1 1.05,41.7 v1.91,42.55
N$2  (via drill 0.35)
  Top 0.406: v5.08,42.55 R15.1
  Bottom 0.406: U10.3 5.05,42.52 v5.08,42.55
N$3
  Top 0.305: U6.20 27.09,41.7 27.94,42.55 29.67,42.55 R12.1
N$4  (via drill 0.35)
  Top 0.305: U8.1 49.49,23.5 v49.53,23.45 | v64.39,22.18 64.45,22.12 Q1.1
  Bottom 0.305: v49.53,23.45 50.8,22.18 v64.39,22.18
N$5
  Top 0.406: U8.3 46.99,20.95 45.72,22.23 R5.1 45.68,25.82 R6.2
N$6
  Top 0.305: U8.6 U8.7
N$7
  Top 1.219: U1.3 U1.4
  Bottom 1.219: J1.1 60.92,50.84 72.45,39.31 U1.4
N$8
  Top 0.305: U6.23 24.7,42.86 26.67,44.83 X1.2 C15.2
N$9
  Top 0.305: U8.5 R10.2 R9.1
N$10
  Top 0.305: U6.24 23.89,42.78 21.59,45.09 X1.1 C14.2
N$11
  Top 0.305: U3.P16 66.48,14.8 67.96,13.32 USB1.P2
N$12
  Top 0.305: U3.P15 67.13,15.09 68.25,13.97 USB1.P3
N$13
  pour Top (isolate 0.305, no thermals): 71.63,12.91 77.22,12.91 77.22,10.76 71.63,10.76
N$14
  pour Top (isolate 0.305, no thermals): 70.36,10.25 74.68,10.25 74.68,7.83 70.36,7.83
N$16
  pour Top (isolate 0.305, no thermals): 70.36,17.61 77.22,17.61 77.22,14.95 70.36,14.95
N$17
  Top 0.305: 58.67,9.91 58.68,9.9 U3.P1
  Top 0.406: R7.1 57.44,12.03 58.67,10.79 58.67,9.91
N$18
  Top 0.305: 61.28,10.35 U3.P5
  Top 0.406: R8.1 57.78,13.84 61.28,10.35
N$19
  pour Top (isolate 0.305, no thermals): 57.15,40.01 64.77,40.01 67.94,43.18 67.94,50.8 67.31,51.44 66.04,51.44 65.41,52.07 65.41,53.98 68.58,53.98 69.85,52.7 69.85,47.62 72.39,45.09 73.66,45.09 73.66,41.27 68.2,35.81 57.15,35.81
N$20
  Top 0.406: SG1.+ 8.64,13.97 24.98,13.97 R16.2
N$21
  Top 0.305: R4.1 55.66,58.85 LED1.C
N$22
  Top 0.406: U5.P3 56.52,5.08 X2.P1
N$23
  Top 0.406: U5.P2 56.52,3.81 X2.P2
N$24
  Top 0.61: U5.P8 45.72,2.54 43.08,5.18 BATT1.1
N$25  (via drill 0.35)
  Top 0.406: v12.7,26.04 R20.2
  Bottom 0.406: U10.10 13.05,25.68 v12.7,26.04
N$26  (via drill 0.35)
  Top 0.406: v10.79,20.32 R19.2
  Bottom 0.406: U10.11 11.05,20.58 v10.79,20.32
N$27  (via drill 0.35)
  Top 0.406: v8.89,20.32 R18.2
  Bottom 0.406: U10.12 9.05,20.48 v8.89,20.32
N$28  (via drill 0.35)
  Top 0.305: U9.15 34.38,44.41 34.04,44.07 34.04,42.42 34.54,41.91 v35.35,41.91
  Bottom 0.406: U10.15 3.06,28.45 4.9,30.3 13.82,30.3 19.08,35.56 27.94,35.56 34.29,41.91 v35.35,41.91
PIEZO
  Top 0.406: U6.1 31.25,22.95 R16.1
RFID_CLOCK
  Top 0.305: U6.11 37.56,35.02 38.61,36.07 38.61,46.86 39.97,48.22 U9.5
RFID_CLOCK_3V  (via drill 0.35)
  Top 0.305: v40.01,46.99 40.05,46.95 U9.4
  Bottom 0.305: J5.2 33.65,53.34 v40.01,46.99
RFID_DATA
  Top 0.305: U6.10 38.03,34.22 39.24,35.43 39.24,44.96 40.01,45.72 41.77,45.72 U9.3
RFID_DATA_3V  (via drill 0.35)
  Top 0.305: v40.01,44.45 40.05,44.41 U9.2
  Bottom 0.305: J5.1 31.11,53.98 40.01,45.09 v40.01,44.45
RFID_MISO
  Top 0.305: U6.13 36.62,36.62 37.34,37.34 37.34,49.4 38.73,50.8 J5.4
RFID_MOSI
  Top 0.305: U6.12 37.09,35.82 37.97,36.7 37.97,48.64 40.09,50.76 U9.7
RFID_MOSI_3V  (via drill 0.35)
  Top 0.305: v40.01,49.53 40.05,49.49 U9.6
  Bottom 0.305: J5.3 36.19,52.71 39.37,49.53 v40.01,49.53
RFID_RESET
  Top 0.305: U9.9 34.25,52.03 33.15,50.93 33.15,42.04 34.04,41.15 34.04,38.73 33.52,38.22 U6.15
RFID_RESET_3V  (via drill 0.35)
  Top 0.305: U9.10 35.7,50.8 37.45,50.8 37.85,51.19 v37.85,53.09
  Bottom 0.305: v37.85,53.09 42.29,53.09 46.35,57.15 J5.7
RTC_CLOCK  (via drill 0.35)
  Top 0.305: 29.5,39.66 U6.17
  Top 0.406: v33.66,24.13 33.66,23.73 34.41,22.97 36.34,22.97 45.72,13.59 45.72,4.45 46.35,3.81 U5.P7 | v27.69,31.37 27.69,37.85 29.5,39.66
  Bottom 0.406: v27.69,31.37 27.69,30.1 v33.66,24.13
RTC_DATA  (via drill 0.35)
  Top 0.305: 30.13,39.02 U6.16
  Top 0.406: v34.92,24.13 36.45,24.13 46.61,13.97 46.61,5.71 47.24,5.08 U5.P6 | v28.83,31.37 28.83,37.72 30.13,39.02
  Bottom 0.406: v28.83,31.37 28.83,30.23 v34.92,24.13
RTC_EN  (via drill 0.35)
  Top 0.305: 32.38,30.22 U6.5
  Top 0.406: v41.27,24 35.06,30.22 32.38,30.22 | U5.P5 v47.62,6.35
  Bottom 0.406: v47.62,6.35 41.27,12.7 v41.27,24
SW1  (via drill 0.35)
  Top 0.305: R11.1 33.34,31.02 U6.6 30.13,31.02
  Top 0.406: J4.1 22.1,1.78 v34.92,14.61 | R11.1 33.31,30.99 | 30.13,31.02 27.94,28.83 v27.94,28.57
  Bottom 0.406: v27.94,28.57 31.7,24.81 31.7,23.85 34.44,21.11 35.56,19.99 35.56,15.24 v34.92,14.61
UART_RX
  Top 0.305: U6.2 32.38,27.82
  Top 0.406: 32.38,27.82 34.92,27.82 43.43,19.3 44.54,19.3 46.44,17.4 49.78,17.4 50.8,16.38 50.8,13.42 52.2,12.03 R7.2
UART_TX
  Top 0.305: 32.38,28.62 U6.3 | 33.66,28.57 33.61,28.62
  Top 0.406: 33.66,28.57 35.43,28.57 43.81,20.19 45.05,20.19 46.91,18.33 50.25,18.33 51.67,16.91 51.67,14.2 52.03,13.84 R8.2 | 33.61,28.62 32.38,28.62
VIN
  Top 0.406: D1.C 49.53,52.7 48.26,53.98 46.35,53.98 45.02,52.64 45.02,40.58 44.07,39.62 44.07,29.84 45.72,28.19 R5.2
  pour Top (isolate 0.305, no thermals): 50.8,54.06 57.02,54.06 57.02,49.78 50.8,49.78
VO33  (via drill 0.35)
  Top 0.305: U3.P17 65.83,14.86 | U3.P19 64.53,13.97 | U3.P4 v60.63,8 60.63,7.08 C5.1
  Top 0.406: 65.83,14.86 65.83,13.97 64.53,13.97 64.08,13.97 62.18,12.06 v61.59,12.06 | U3.P17 65.83,17.57 67.09,18.84 C6.1
  Bottom 0.406: v61.59,12.06 61.59,8.38 61.21,8 v60.63,8
VUSB  (via drill 0.35)
  Top 0.406: U3.P20 63.88,14.98 v62.87,13.97 62.45,13.55 59.44,13.55 57.11,15.88 C4.2
  Bottom 0.406: v62.87,13.97 68.71,13.97 v68.71,12.06
  other vias: 64.64,18.41 68.71,7.87 62.23,18.41
  pour Bottom (isolate 0.305, no thermals): 69.6,6.22 69.6,17.4 67.18,19.81 61.59,19.81 61.59,17.97 66.42,17.97 67.82,16.58 67.82,6.22
  pour Top (isolate 0.305, no thermals): 67.82,12.79 69.6,12.79 69.6,6.18 67.82,6.18
  pour Top (isolate 0.305, no thermals): 61.59,19.77 65.28,19.77 65.28,18.03 61.59,18.03

### Text on the board
tNames: PWR | RF ID READER | DISPLAY | POWER | LEADTECH INC | VREG CTRL | BUTTON | v.trocio
bNames: 5V | GND | DATA | CLK | MOSI | MISO | NC | GND | RST | 3V3 | CLK | SDA | PREPAID METERING MAIN BOARD / V1.0 | !VREG_EN | ADC | GND | BUTTON | GND | MAR 2020